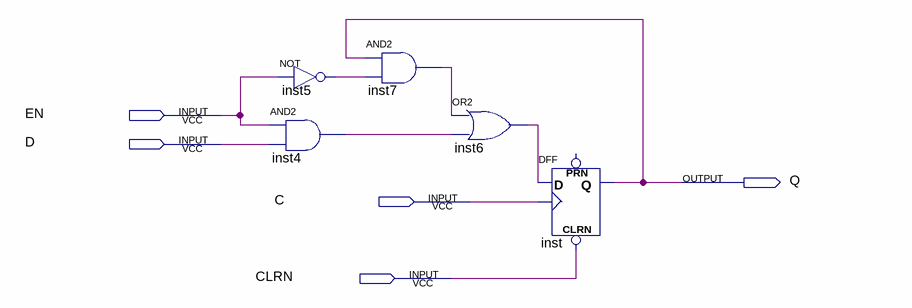
[diagram p0: schematic sheet]
// Quartus schematic dchufa.bdf as structural Verilog: 5 symbols, 5 pins
module dchufa (
  input  EN,
  input  D,
  input  C,
  input  CLRN,
  output Q
);

  wire inst4_out, inst5_out, inst6_out, inst7_out;

  and inst4 (inst4_out, EN, D);
  not inst5 (inst5_out, EN);
  and inst7 (inst7_out, Q, inst5_out);
  or inst6 (inst6_out, inst7_out, inst4_out);
  DFF inst (.CLRN(CLRN), .CLK(C), .D(inst6_out), .Q(Q));  // open: PRN
endmodule
